# EAGLE design makeToneBoard (EAGLE 6.4)
Name: Scout v1.0 Designers: Jeffrey R. Groff and Jared Tomlin Date: 09/01/2013
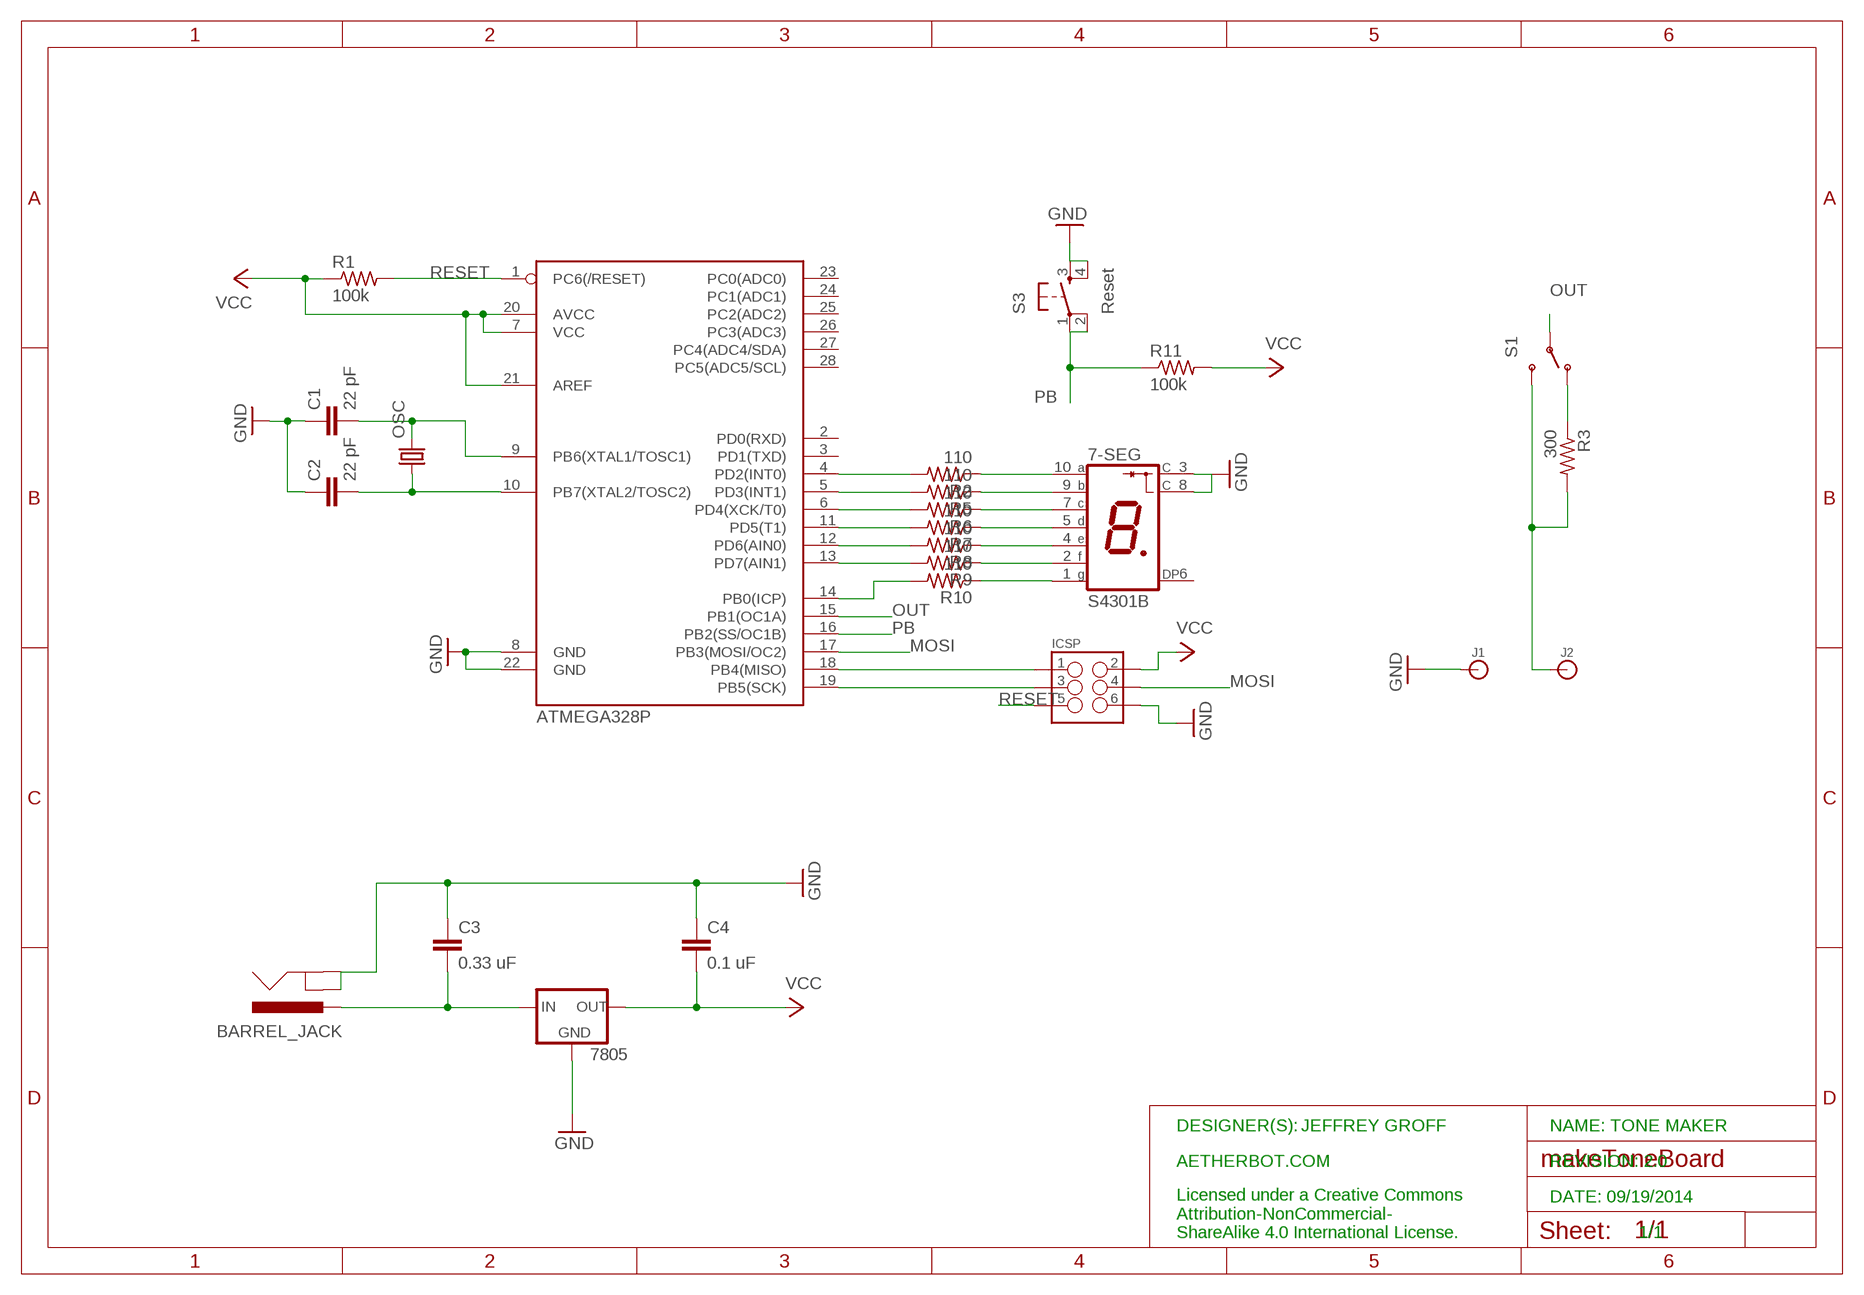
[diagram p0: schematic, sheet 1]

## Parts
7-SEG  S4301B  [S4301B]
7805  V_REG_78XXSINK  [TO220-IGO]
BARREL_JACK  POWER_JACKPTH  [POWER_JACK_PTH]
C1  22 pF  CAPKIT  [CAP-PTH-SMALL-KIT]
C2  22 pF  CAPKIT  [CAP-PTH-SMALL-KIT]
C3  0.33 uF  CAPEZ  [CAP-PTH-SMALLEZ]
C4  0.1 uF  CAPEZ  [CAP-PTH-SMALLEZ]
ICSP  M03X2NO_SILK  [2X3-NS]
J1  BANANA_CONN  [BANANA_CONN]
J2  BANANA_CONN  [BANANA_CONN]
OSC  CRYSTALHC49S  [HC49/S]
R1  100k  R-US_0204/7  [0204/7]
R2  110  R-US_0204/7  [0204/7]
R3  300  R-US_0204/7  [0204/7]
R5  110  R-US_0204/7  [0204/7]
R6  110  R-US_0204/7  [0204/7]
R7  110  R-US_0204/7  [0204/7]
R8  110  R-US_0204/7  [0204/7]
R9  110  R-US_0204/7  [0204/7]
R10  110  R-US_0204/7  [0204/7]
R11  100k  R-US_0204/7  [0204/7]
S1  LED PWR  SWITCH-SPDTPTH  [SWITCH-SPDT]
S3  Reset  TAC_SWITCHPTH  [TACTILE-PTH]
U1  ATMEGA328P  ATMEGA328P_PDIP  [DIL28-3]

## Nets
GND: 7-SEG.3(C) 7-SEG.8(C) 7805.GND BARREL_JACK.GND BARREL_JACK.GNDBREAK C1.1 C2.1 C3.1 C4.1 ICSP.6 J1.P$1 S3.3 S3.4 U1.8(GND) U1.22(GND)
MOSI: ICSP.4 U1.17(PB3(MOSI/OC2))
N$1: R2.2 U1.4(PD2(INT0))
N$2: R3.1 S1.1(O)
N$3: J2.P$1 R3.2 S1.3(S)
N$4: 7-SEG.1(G) R10.1
N$5: C2.2 OSC.1 U1.10(PB7(XTAL2/TOSC2))
N$6: 7-SEG.10(A) R2.1
N$7: R5.2 U1.5(PD3(INT1))
N$8: 7-SEG.9(B) R5.1
N$9: R6.2 U1.6(PD4(XCK/T0))
N$10: 7805.IN BARREL_JACK.PWR C3.2
N$11: 7-SEG.7(C) R6.1
N$12: R7.2 U1.11(PD5(T1))
N$13: 7-SEG.5(D) R7.1
N$14: ICSP.1 U1.18(PB4(MISO))
N$15: ICSP.3 U1.19(PB5(SCK))
N$16: R8.2 U1.12(PD6(AIN0))
N$17: 7-SEG.4(E) R8.1
N$18: R9.2 U1.13(PD7(AIN1))
N$20: 7-SEG.2(F) R9.1
N$21: R10.2 U1.14(PB0(ICP))
N$23: C1.2 OSC.2 U1.9(PB6(XTAL1/TOSC1))
OUT: S1.2(P) U1.15(PB1(OC1A))
PB: R11.1 S3.1 S3.2 U1.16(PB2(SS/OC1B))
RESET: ICSP.5 R1.2 U1.1(PC6(/RESET))
VCC: 7805.OUT C4.2 ICSP.2 R1.1 R11.2 U1.7(VCC) U1.20(AVCC) U1.21(AREF)
Unconnected: 7-SEG.6(DP) U1.2(PD0(RXD)) U1.3(PD1(TXD)) U1.23(PC0(ADC0)) U1.24(PC1(ADC1)) U1.25(PC2(ADC2)) U1.26(PC3(ADC3)) U1.27(PC4(ADC4/SDA)) U1.28(PC5(ADC5/SCL))

## Notes on the sheet
- DESIGNER(S): | JEFFREY GROFF | NAME: TONE MAKER
- AETHERBOT.COM | REVISION: 2.0
- DATE: 09/19/2014
- Licensed under a Creative Commons
  Attribution-NonCommercial-
  ShareAlike 4.0 International License.
- 1/1

## Library data of the parts
7-SEG = led-7-segment:S4301B: Single Digit Seven-Segment Display (cathode common) Source: LITEON .. S4301B.pdf; OC_FARNELL: unknown; OC_NEWARK: unknown
7805 = SparkFun-PowerIC:V_REG_78XX: Voltage Regulator Standard 7805 5V regulator. IGO (Input Ground Output). Spark Fun Electronics SKU : COM-00107
BARREL_JACK = SparkFun-Connectors:POWER_JACK: Power Jack This is the standard 5.5mm barrel jack for power. The PTH is the most common, proven, reliable, footprint. The Slot footprint only works if the mill layer is transmitted to the PCB fab house so be warned. Spark Fun Electronics SKU : PRT-00119 SMT: CONN-08106 Mating wall wart : TOL-00298 (and others)
C1-C4 = SparkFun-Capacitors:CAP: Capacitor Standard 0603 ceramic capacitor, and 0.1" leaded capacitor.
ICSP = SparkFun-Connectors:M03X2: 2x3 .1" header. Shrouded, with keying- CONN-10681 SMT- CONN-11415 Pogo pins- HW-11044
J1 J2 = SparkFun-Connectors:BANANA_CONN: Through-hole banana jack
OSC = crystal:CRYSTAL: CRYSTAL; OC_FARNELL: 1667008; OC_NEWARK: unknown
R1-R3 R5-R11 = resistor:R-US_: RESISTOR, American symbol
S1 = SparkFun-Electromechanical:SWITCH-SPDT: SPDT Switch Simple slide switch, Spark Fun Electronics SKU : COM-00102 DPDT SMT slide switch, AYZ0202, SWCH-08179
S3 = SparkFun-Electromechanical:TAC_SWITCH: Momentary Switch Button commonly used for reset or general input. Spark Fun Electronics SKU : COM-00097 SMT- SWCH-08247
U1 = SparkFun-DigitalIC:ATMEGA328P_PDIP: uC used in the Arduino 32kb flash, 1k EEPROM, 2k SRAM This is the through-hole version of this chip.

## Board
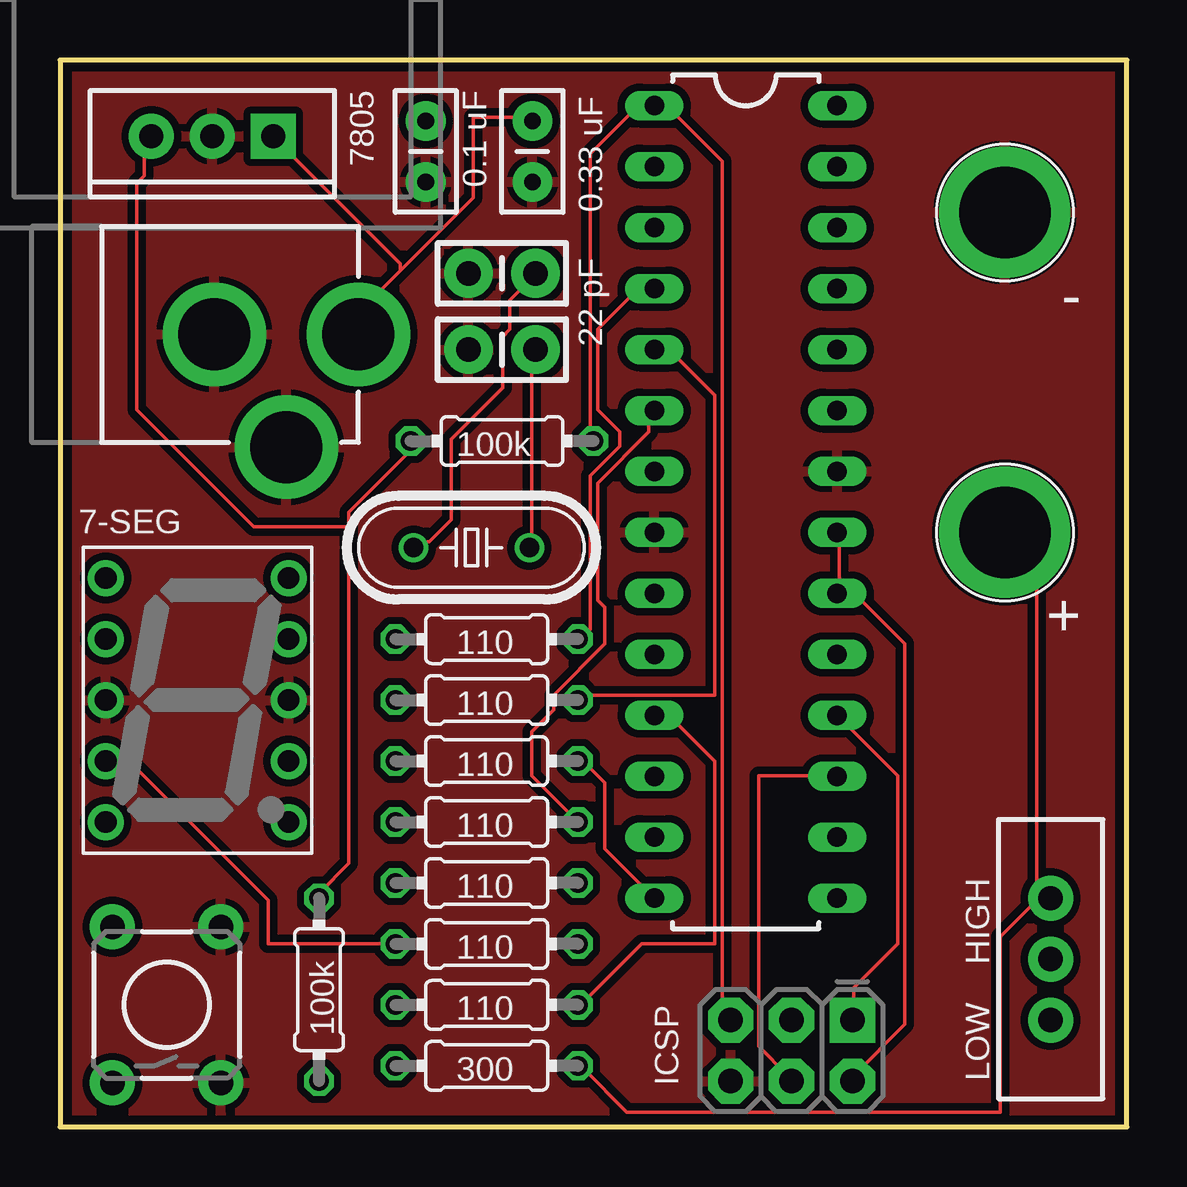
[diagram p1: board, top side]
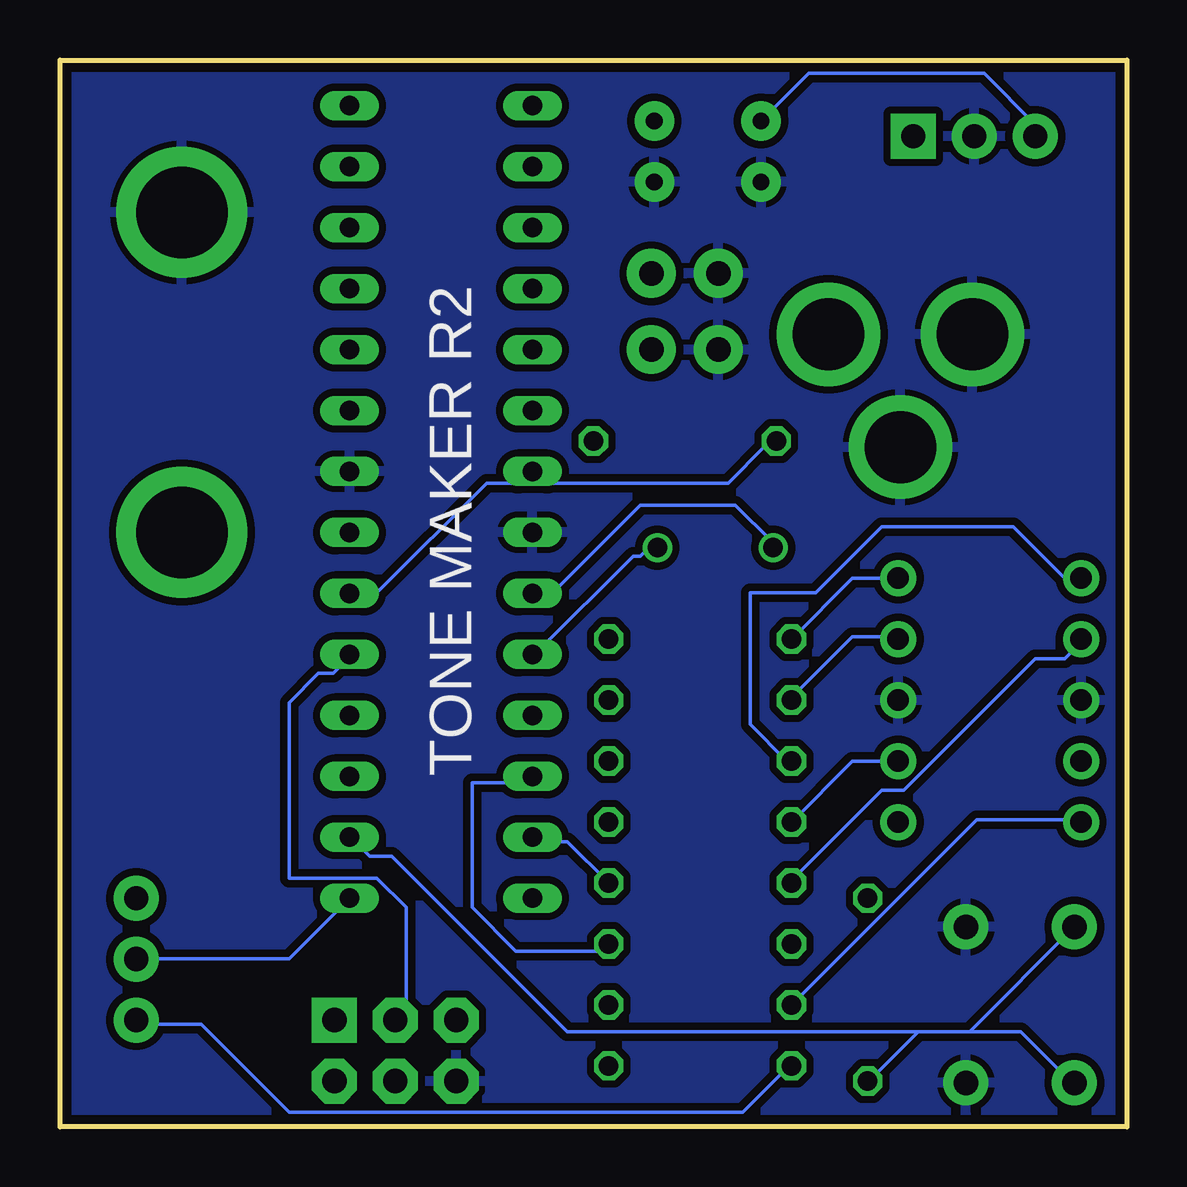
[diagram p2: board, bottom side, seen from below]

Size 44.45 x 44.45 mm. Coordinates in mm from the lower left corner, seen from the top.
Outline: 0,44.45 0,0 44.45,0 44.45,44.45 0,44.45
Copper layers (1*16): Top 0.0356mm / dielectric 1.5011mm / Bottom 0.0356mm
Design rules "LaenPCBOrder": minimum track width 6mil, minimum drill 13mil, track to track 6mil, track to pad 6mil, pad to pad 6mil, via to via 6mil, smd to smd 6mil, copper to edge 15mil, drill to drill 6mil, minimum pad ring 7mil, minimum via ring 7mil, stop-mask expansion 3mil, vias tented up to drill 0mil, thermal gap 10mil

### Footprints (pad centres in the part's own frame; a part is rotated, then mirrored left to right if it is on the bottom)
S4301B = drill 0.9 pad 1.5: 1 -3.81,5.08; 2 -3.81,2.54; 3 -3.81,0; 4 -3.81,-2.54; 5 -3.81,-5.08; 6 3.81,-5.08; 7 3.81,-2.54; 8 3.81,0; 9 3.81,2.54; 10 3.81,5.08
TO220-IGO = drill 1 pad 1.88: GND 0,0; OUT 2.54,0 | drill 1 pad 1.88 square: IN -2.54,0
POWER_JACK_PTH = drill 2.997 pad 4.318: GND 0,7.7; GNDBREAK 4.7,10.7; PWR 0,13.7
CAP-PTH-SMALL-KIT = drill 1.016 pad 2.032: 1 -1.397,0; 2 1.397,0
CAP-PTH-SMALLEZ = drill 0.7 pad 1.651: 1 0,0; 2 2.54,0
2X3-NS = drill 1.016 pad 1.88 square: 1 -2.54,-1.27 | drill 1.016 pad 1.88 octagon: 2 -2.54,1.27; 3 0,-1.27; 4 0,1.27; 5 2.54,-1.27; 6 2.54,1.27
BANANA_CONN = drill 3.81 pad 5.461: P$1 0,0
HC49/S = drill 0.813: 1 -2.413,0; 2 2.413,0
0204/7 = drill 0.813 octagon: 1 -3.81,0; 2 3.81,0
SWITCH-SPDT = drill 1.016 pad 1.88: 1 0,2.54; 2 0,0; 3 0,-2.54
TACTILE-PTH = drill 1.016 pad 1.88: 1 -3.251,2.261; 2 3.251,2.261; 3 -3.251,-2.261; 4 3.251,-2.261
DIL28-3 = drill 0.813 long: 1 -16.51,-3.81; 2 -13.97,-3.81; 3 -11.43,-3.81; 4 -8.89,-3.81; 5 -6.35,-3.81; 6 -3.81,-3.81; 7 -1.27,-3.81; 8 1.27,-3.81; 9 3.81,-3.81; 10 6.35,-3.81; 11 8.89,-3.81; 12 11.43,-3.81; 13 13.97,-3.81; 14 16.51,-3.81; 15 16.51,3.81; 16 13.97,3.81; 17 11.43,3.81; 18 8.89,3.81; 19 6.35,3.81; 20 3.81,3.81; 21 1.27,3.81; 22 -1.27,3.81; 23 -3.81,3.81; 24 -6.35,3.81; 25 -8.89,3.81; 26 -11.43,3.81; 27 -13.97,3.81; 28 -16.51,3.81

### Placement (x,y rotation side)
7-SEG  5.71,17.78 0 top
7805  6.35,41.27 180 top
BARREL_JACK  -1.27,33.02 270 top
C1  18.42,35.56 0 top
C2  18.42,32.39 0 top
C3  19.68,39.37 90 top
C4  15.24,39.37 90 top
ICSP  30.48,3.18 180 top
J1  39.37,38.1 180 top
J2  39.37,24.76 0 top
OSC  17.14,24.13 180 top
R1  18.42,28.57 0 top
R2  17.78,20.32 0 top
R3  17.78,2.54 0 top
R5  17.78,17.78 0 top
R6  17.78,12.7 0 top
R7  17.78,5.08 0 top
R8  17.78,7.62 0 top
R9  17.78,10.16 0 top
R10  17.78,15.24 0 top
R11  10.79,5.71 90 top
S1  41.28,6.99 180 top
S3  4.45,5.08 90 top
U1  28.57,26.04 270 top

### Tracks (layer width: path | path; a pad name or v marks a point on that pad's centre or on a via)
GND
  pour Bottom (isolate 0.305): 0,44.45 44.45,44.45 44.45,0 0,0
  pour Top (isolate 0.305): 0,44.45 44.45,44.45 44.45,0 0,0
MOSI
  Top 0.152: U1.17 32.16,14.63 29.11,14.63 29.11,3.35 30.33,2.13 ICSP.4
N$1
  Top 0.152: R2.2 21.79,20.42 22.1,20.73 22.1,27.13 23.32,28.35 23.32,28.96 22.4,29.87 22.4,33.22 23.93,34.75 24.54,34.75 U1.4
N$2
  Bottom 0.152: R3.1 14.17,2.44 16,0.61 34.9,0.61 38.56,4.27 41,4.27 S1.1
N$3
  Top 0.152: 40.69,9.45 41,9.75 S1.3 40.69,9.45 | 40.69,9.45 39.17,7.93 39.17,0.61 23.62,0.61 21.79,2.44 R3.2 | 40.69,9.45 40.69,23.47 39.47,24.69 J2.P$1
N$4
  Bottom 0.152: 7-SEG.1 2.59,22.86 4.72,24.99 10.21,24.99 12.95,22.25 15.7,22.25 15.7,16.76 14.17,15.24 R10.1
N$5
  Top 0.152: C2.2 19.66,32.31 19.66,24.38 OSC.1
  Bottom 0.152: U1.10 24.54,19.81 20.57,23.77 20.27,23.77 19.96,24.08 19.66,24.08 OSC.1
N$6
  Bottom 0.152: R2.1 11.43,22.86 7-SEG.10
N$7
  Top 0.152: R5.2 21.79,17.98 27.28,17.98 27.28,30.48 25.45,32.31 24.84,32.31 U1.5
N$8
  Bottom 0.152: R5.1 13.87,17.98 11.43,20.42 9.6,20.42 7-SEG.9
N$9
  Top 0.152: R6.2 19.66,14.63 19.66,16.46 20.57,17.37 20.57,17.98 22.71,20.12 22.71,21.64 22.4,21.95 22.4,26.82 24.54,28.96 24.54,29.57 U1.6
N$10
  Top 0.152: 14.17,35.66 12.65,34.14 12.65,33.22 BARREL_JACK.PWR | 14.17,35.66 17.22,38.71 17.22,42.06 19.66,42.06 C3.2 | 14.17,35.66 14.17,35.97 8.99,41.15 7805.IN
N$11
  Bottom 0.152: R6.1 11.43,15.24 7-SEG.7
N$12
  Top 0.152: R7.2 21.79,5.18 24.23,7.62 27.28,7.62 27.28,15.24 25.45,17.07 24.84,17.07 U1.11
N$13
  Bottom 0.152: R7.1 6.25,12.8 1.98,12.8 7-SEG.5
N$14
  Top 0.152: U1.18 34.9,14.63 34.9,7.62 33.07,5.79 33.07,4.57 ICSP.1
N$15
  Bottom 0.152: U1.19 32.46,19.51 33.07,18.9 33.68,18.9 34.9,17.68 34.9,10.36 31.24,10.36 30.02,9.14 30.02,4.57 30.33,4.57 ICSP.3
N$16
  Bottom 0.152: R8.2 21.79,7.62 22.1,7.32 25.45,7.32 27.28,9.14 27.28,14.33 24.84,14.33 U1.12
N$17
  Top 0.152: R8.1 8.69,7.62 8.69,9.45 2.9,15.24 7-SEG.4
N$18
  Bottom 0.152: R9.2 23.32,11.89 24.54,11.89 U1.13
N$20
  Bottom 0.152: R9.1 13.87,10.36 10.21,14.02 9.3,14.02 3.81,19.51 2.59,19.51 1.98,20.12 7-SEG.2
N$21
  Top 0.152: U1.14 22.71,11.58 22.71,14.33 21.79,15.24 R10.2
N$23
  Top 0.152: C1.2 19.66,35.36 18.75,34.44 18.75,33.22 18.44,32.92 18.44,30.79 16.31,28.65 16.31,25.3 15.39,24.38 14.78,24.38 OSC.2
  Bottom 0.152: OSC.2 14.78,24.38 16.31,25.91 20.27,25.91 23.93,22.25 24.54,22.25 U1.9
OUT
  Bottom 0.152: U1.15 34.9,7.01 41,7.01 S1.2
PB
  Bottom 0.152: 8.69,3.96 10.52,2.13 R11.1 | 6.55,3.96 4.42,3.96 2.29,1.83 S3.1 | 6.55,3.96 8.69,3.96 | 8.69,3.96 23.32,3.96 30.63,11.28 31.55,11.28 32.16,11.89 U1.16 | 6.55,3.96 S3.2
RESET
  Top 0.152: R1.2 22.1,28.65 22.1,40.54 23.93,42.37 24.54,42.37 U1.1 24.84,42.37 25.45,42.37 27.58,40.23 27.58,4.88 27.89,4.57 ICSP.5
VCC
  Top 0.152: 32.46,22.86 32.46,24.69 U1.21 | 32.46,22.86 32.46,22.25 U1.20 | 32.46,22.86 35.2,20.12 35.2,4.27 33.07,2.13 ICSP.2 | 12.04,24.99 12.04,25.6 14.48,28.04 14.48,28.35 R1.1 | 12.04,24.99 12.04,10.97 10.82,9.75 R11.2 | 12.04,24.99 8.08,24.99 3.2,29.87 3.2,39.32 3.5,39.62 3.5,40.84 3.81,41.15 7805.OUT
  Bottom 0.152: U1.20 32.16,22.25 31.24,22.25 26.67,26.82 25.15,26.82 24.84,27.13 U1.7 24.54,27.13 24.23,26.82 16.61,26.82 15.09,28.35 14.78,28.35 R1.1 | C4.2 13.26,43.89 5.94,43.89 3.81,41.76 7805.OUT

### Text on the board
tPlace: 7805 | 22 pF | - | 100k | + | 110 | 110 | 110 | 110 | 110 | 110 | 110 | 100k | 300 | LOW HIGH
bPlace: TONE MAKER R2